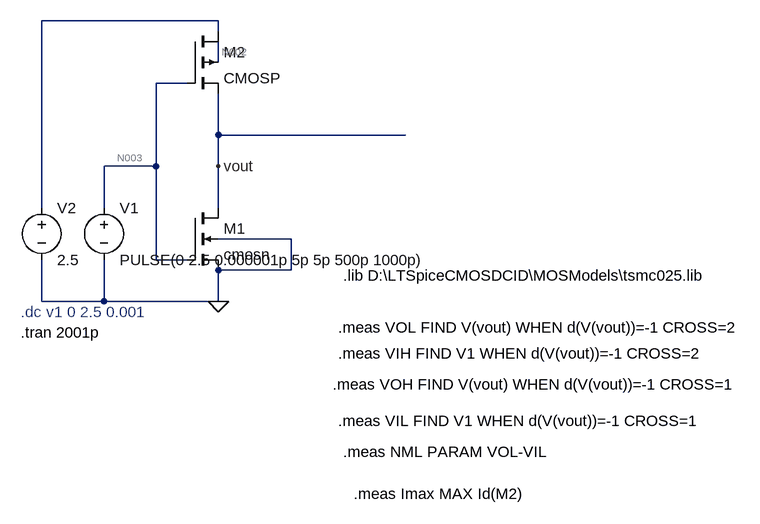
[diagram p0: schematic lab_mid.asc]
lab_mid.asc, the LTspice schematic file:
Version 4
SHEET 1 1064 680
WIRE 224 -272 -48 -272
WIRE 224 -256 224 -272
WIRE 224 -208 224 -240
WIRE 176 -176 128 -176
WIRE 224 -96 224 -160
WIRE 512 -96 224 -96
WIRE 128 -48 128 -176
WIRE 128 -48 48 -48
WIRE 224 -48 224 -96
WIRE -48 16 -48 -272
WIRE 48 16 48 -48
WIRE 224 16 224 -48
WIRE 336 64 224 64
WIRE 128 96 128 -48
WIRE 176 96 128 96
WIRE 336 112 336 64
WIRE 336 112 224 112
WIRE -48 160 -48 96
WIRE 48 160 48 96
WIRE 48 160 -48 160
WIRE 224 160 224 112
WIRE 224 160 48 160
FLAG 224 -48 vout
FLAG 224 160 0
SYMBOL nmos4 176 16 R0
SYMATTR InstName M1
SYMATTR Value cmosn
SYMATTR Value2 l=240n w=480n ad=0.1728p as=0.1728p pd=1680n ps=1680n
SYMBOL voltage 48 0 R0
WINDOW 123 0 0 Left 0
WINDOW 39 0 0 Left 0
SYMATTR InstName V1
SYMATTR Value PULSE(0 2.5 0.000001p 5p 5p 500p 1000p)
SYMBOL voltage -48 0 R0
WINDOW 123 0 0 Left 0
WINDOW 39 0 0 Left 0
SYMATTR InstName V2
SYMATTR Value 2.5
SYMBOL cmosp 176 -256 R0
SYMATTR InstName M2
SYMATTR Value2 l=240n w=1668n ad=0.1728p as=0.1728p pd=1680n ps=1680n
TEXT -80 176 Left 2 ;.dc v1 0 2.5 0.001
TEXT 416 120 Left 2 !.lib D:\\LTSpiceCMOSDCID\\MOSModels\\tsmc025.lib
TEXT 408 200 Left 2 !.meas VOL FIND V(vout) WHEN d(V(vout))=-1 CROSS=2
TEXT 408 240 Left 2 !.meas VIH FIND V1 WHEN d(V(vout))=-1 CROSS=2
TEXT 400 288 Left 2 !.meas VOH FIND V(vout) WHEN d(V(vout))=-1 CROSS=1
TEXT 408 344 Left 2 !.meas VIL FIND V1 WHEN d(V(vout))=-1 CROSS=1
TEXT 416 392 Left 2 !.meas NML PARAM VOL-VIL
TEXT 432 456 Left 2 !.meas Imax MAX Id(M2)
TEXT -80 208 Left 2 !.tran 2001p

The netlist it stands for:
* lab_mid.asc
M1 vout N003 0 0 cmosn l=240n w=480n ad=0.1728p as=0.1728p pd=1680n ps=1680n
V1 N003 0 PULSE(0 2.5 0.000001p 5p 5p 500p 1000p)
V2 N001 0 2.5
M2 N001 N003 vout N002 CMOSP l=240n w=1668n ad=0.1728p as=0.1728p pd=1680n ps=1680n
.model NMOS NMOS
.model PMOS PMOS
.lib standard.mos
* .dc v1 0 2.5 0.001
.lib D:\LTSpiceCMOSDCID\MOSModels\tsmc025.lib
.meas VOL FIND V(vout) WHEN d(V(vout))=-1 CROSS=2
.meas VIH FIND V1 WHEN d(V(vout))=-1 CROSS=2
.meas VOH FIND V(vout) WHEN d(V(vout))=-1 CROSS=1
.meas VIL FIND V1 WHEN d(V(vout))=-1 CROSS=1
.meas NML PARAM VOL-VIL
.meas Imax MAX Id(M2)
.tran 2001p
.backanno
.end

* Results of the author's LTspice run, read from the files saved beside the schematic
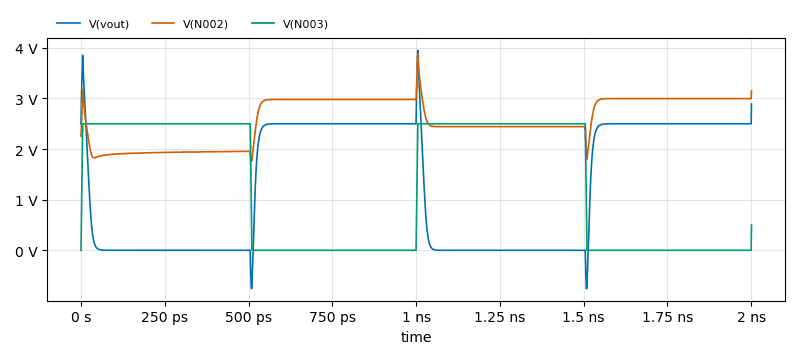
[diagram p1: Transient Analysis of lab_mid.asc, plotted from the saved traces]
* Transient Analysis, 1 run:
*   V(vout): min -760.9 mV, max 3.951 V, average 1.265 V, rms 1.778 V, last 2.893 V
*   V(N002): min 1.762 V, max 3.883 V, average 2.583 V, rms 2.621 V, last 3.15 V
*   V(N003): min 0 V, max 2.5 V, average 1.262 V, rms 1.773 V, last 500 mV
* From the log:
*   vol: v(vout)=-0.756329 at 5.08715e-10
*   Measurement "vih" FAIL'ed
*   voh: v(vout)=3.85315 at 5.00724e-12
*   Measurement "vil" FAIL'ed
*   Measurement "nml" FAIL'ed
*   imax: MAX(id(m2))=0.00153653 FROM 0 TO 2.001e-09